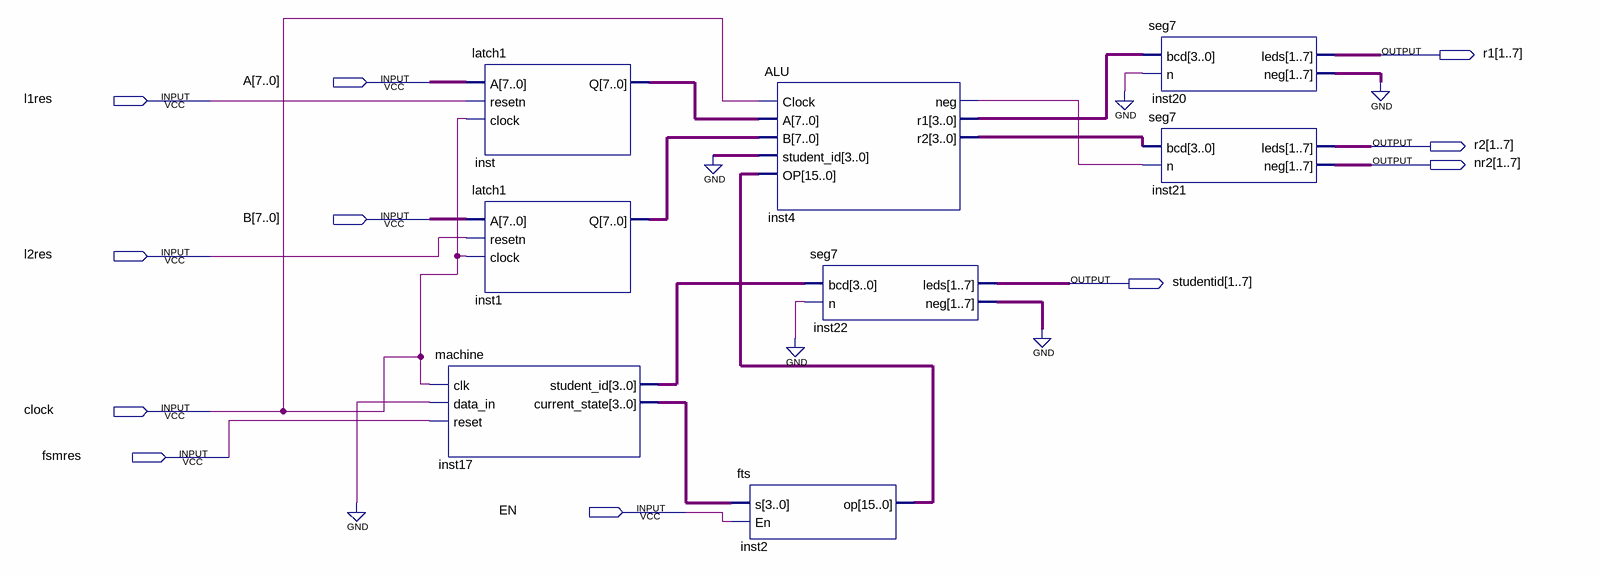
[diagram p0: schematic sheet]
// Quartus schematic gpu.bdf as structural Verilog: 8 symbols, 11 pins
module gpu (
  input  [7:0] A,
  input  l1res,
  input  [7:0] B,
  input  l2res,
  input  clock,
  input  fsmres,
  input  EN,
  output [1:7] r1,
  output [1:7] r2,
  output [1:7] nr2,
  output [1:7] studentid
);

  wire inst4_neg;
  wire [3:0] inst4_r1, inst4_r2, inst17_current_state, inst17_student_id;
  wire [6:0] inst20_neg, inst22_neg;
  wire [7:0] inst1_q, inst_q;
  wire [15:0] inst2_op;

  machine inst17 (
    .clk(clock), .data_in(1'b0), .reset(fsmres), .student_id(inst17_student_id),
    .current_state(inst17_current_state));
  latch1 inst (.A(A), .resetn(l1res), .clock(clock), .Q(inst_q));
  latch1 inst1 (.A(B), .resetn(l2res), .clock(clock), .Q(inst1_q));
  fts inst2 (.s(inst17_current_state), .En(EN), .op(inst2_op));
  ALU inst4 (
    .Clock(clock), .A(inst_q), .B(inst1_q), .student_id(4'b0000), .OP(inst2_op), .neg(inst4_neg),
    .r1(inst4_r1), .r2(inst4_r2));
  seg7 inst22 (.bcd(inst17_student_id), .n(1'b0), .leds(studentid), .neg(inst22_neg));
  seg7 inst20 (.bcd(inst4_r1), .n(1'b0), .leds(r1), .neg(inst20_neg));
  seg7 inst21 (.bcd(inst4_r2), .n(inst4_neg), .leds(r2), .neg(nr2));
  // also tied to GND on the sheet: {inst20_neg[0], inst20_neg[1], inst20_neg[2], inst20_neg[3], inst20_neg[4], inst20_neg[5], inst20_neg[6], inst22_neg[0], inst22_neg[1], inst22_neg[2], inst22_neg[3], inst22_neg[4], inst22_neg[5], inst22_neg[6]}
endmodule
